# EasyEDA Pro project 2轴4.0控制板PCB源文件（LY-2X4.5-V4-ESD）.eprj, board 2轴4.0-
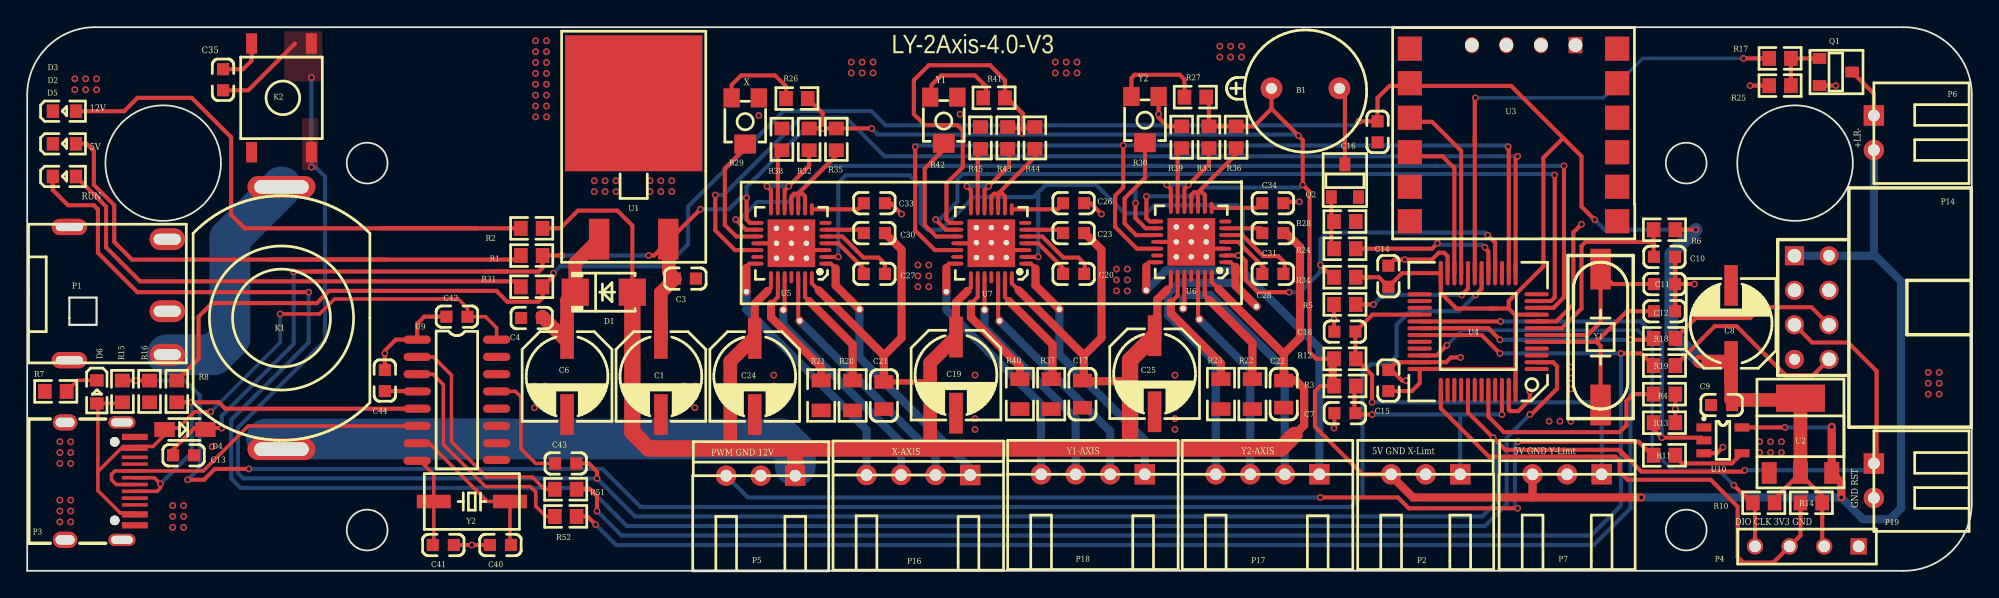
[diagram p1: board, top side]
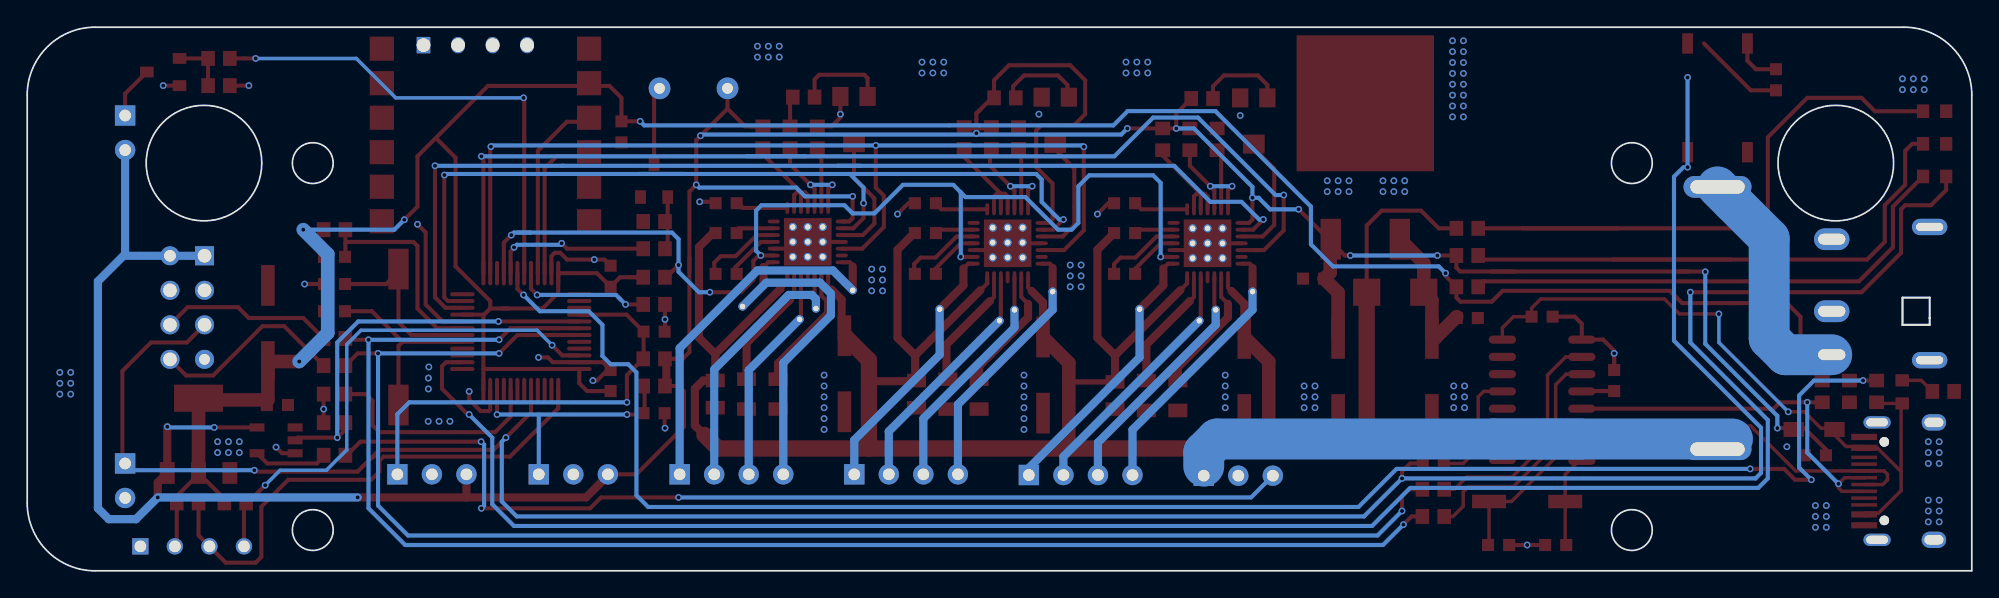
[diagram p2: board, bottom side, seen from below]

Outline 143 x 40 mm; copper layers: Top Layer, Bottom Layer. Coordinates in mm from the lower left corner of the outline.
Outline path: circle c10,30 r4.25 ; circle c25,30 r1.5 ; circle c25,3 r1.5 ; circle c122,30 r1.5 ; circle c122,3 r1.5 ; circle c130,30 r4.25 ; 0,35 0,0 138,0 arc(141.54,1.46) 143,5 143,35 arc(141.54,38.54) 138,40 5,40 arc(1.46,38.54) 0,35
Stack: Top Layer 0.0356mm / Dielectric1 0.32mm FR-4 er 4.8 / Bottom Layer 0.0356mm

## Design rules (mm)
net D6: Outside Board Components
net D5: Outside Board Components
net R15: Outside Board Components
net P3: Outside Board Components
net D2: Outside Board Components
net D3: Outside Board Components
net R7: Outside Board Components
net Y2: Inside Board Components
net U10: Inside Board Components
net U9: Inside Board Components
net R52: Inside Board Components
net R51: Inside Board Components
net C44: Inside Board Components
net C43: Inside Board Components
net C42: Inside Board Components
net C41: Inside Board Components
net C40: Inside Board Components
net R39: Inside Board Components
net R36: Inside Board Components
net R33: Inside Board Components
net R30: Inside Board Components
net R27: Inside Board Components
net U7: Inside Board Components
net U5: Inside Board Components
net R38: Inside Board Components
net R35: Inside Board Components
net R32: Inside Board Components
net R29: Inside Board Components
net R26: Inside Board Components
net R21: Inside Board Components
net R20: Inside Board Components
net P16: Inside Board Components
net C33: Inside Board Components
net C30: Inside Board Components
net C27: Inside Board Components
net C24: Inside Board Components
net C21: Inside Board Components
net R45: Inside Board Components
net R44: Inside Board Components
net R43: Inside Board Components
net R42: Inside Board Components
net R41: Inside Board Components
net R40: Inside Board Components
net R37: Inside Board Components
net C26: Inside Board Components
net C23: Inside Board Components
net C20: Inside Board Components
net C19: Inside Board Components
net C17: Inside Board Components
net U2: Inside Board Components
net U1: Inside Board Components
net R2: Inside Board Components
net R1: Inside Board Components
net D1: Inside Board Components
net C9: Inside Board Components
net C8: Inside Board Components
net C6: Inside Board Components
net C4: Inside Board Components
net C3: Inside Board Components
net C1: Inside Board Components
net R31: Inside Board Components
net R34: Inside Board Components
net Y1: Inside Board Components
net P4: Inside Board Components
net R25: Inside Board Components
net R24: Inside Board Components
net R17: Inside Board Components
net R14: Inside Board Components
net R13: Inside Board Components
net R10: Inside Board Components
net P6: Inside Board Components
net C7: Inside Board Components
net C10: Inside Board Components
net C11: Inside Board Components
net C12: Inside Board Components
net C14: Inside Board Components
net C15: Inside Board Components
net C16: Inside Board Components
net C18: Inside Board Components
net C22: Inside Board Components
net C25: Inside Board Components
net C28: Inside Board Components
net C31: Inside Board Components
net C34: Inside Board Components
net P2: Inside Board Components
net P7: Inside Board Components
net P5: Inside Board Components
net P14: Inside Board Components
net P17: Inside Board Components
net R3: Inside Board Components
net R4: Inside Board Components
net R5: Inside Board Components
net R6: Inside Board Components
net R11: Inside Board Components
net R12: Inside Board Components
net R18: Inside Board Components
net R19: Inside Board Components
net R22: Inside Board Components
net R23: Inside Board Components
net U3: Inside Board Components
net U4: Inside Board Components
net U6: Inside Board Components
net Q1: Inside Board Components
net Q2: Inside Board Components
net R28: Inside Board Components
net B1: Inside Board Components
net P18: Inside Board Components
net P19: Inside Board Components
net C13: Inside Board Components
net D4: Inside Board Components
net K1: Inside Board Components
net K2: Inside Board Components
net P1: Inside Board Components
net R8: Inside Board Components
net R16: Inside Board Components
net C35: Inside Board Components
spacing Clearance (default): track to track 0.178, other pairs 0.178 to 0.178
track width Width (default): min 0.1, default 0.254, max 5
differential pair DiffPairsRouting (default): width min 0.381, default 0.381, max 0.381; gap min 0.254, default 0.254
via RoutingVias (default): diameter min 0.3, default 0.8, max 1.27; hole min 0.3, default 0.6, max 2

## Placement (name value [footprint] x y rotation side)
B1  蜂鸣器  [蜂鸣器9]  94 35.5 0 top
C1  100uF/35V  [电解电容贴片6X6]  46.6 14.3 270 top
C3  104  [0603C]  48.4 21.5 180 top
C4  104  [0603C]  37.1 18.6 0 top
C6  100uF/35V  [电解电容贴片6X6]  39.7 14.3 270 top
C7  103  [0603C]  96.9 11.6 0 top
C8  100uF/35V  [电解电容贴片6X6]  125.3 18.2 90 top
C9  104  [0603C]  124.6 12.2 0 top
C10  104  [0603C]  120.4 23.1 180 top
C11  100pF  [0603C]  120.4 21.1 0 top
C12  100pF  [0603C]  120.4 19.1 0 top
C13  104  [0603C]  11.5 8.5 180 top
C14  104  [0603C]  100.1 21.67 270 top
C15  104  [0603C]  100.1 14 270 top
C16  104  [0603C]  99.3 32.3 90 top
C17  105  [0805C]  77.6 13 270 top
C18  103  [0603C]  96.9 17.6 0 top
C19  100uF/35V  [电解电容贴片6X6]  68.3 14.4 270 top
C20  104  [0603C]  76.95 21.85 0 top
C21  105  [0805C]  63 12.9 270 top
C22  105  [0805C]  92.4 13 270 top
C23  104  [0603C]  76.95 24.85 0 top
C24  100uF/35V  [电解电容贴片6X6]  53.5 14.3 270 top
C25  100uF/35V  [电解电容贴片6X6]  82.91 14.5 270 top
C26  224  [0603C]  76.95 27.05 0 top
C27  104  [0603C]  62.3 21.85 0 top
C28  104  [0603C]  91.6 21.85 0 top
C30  104  [0603C]  62.3 24.85 0 top
C31  104  [0603C]  91.6 24.85 0 top
C33  224  [0603C]  62.3 27.05 0 top
C34  224  [0603C]  91.6 27.05 0 top
C35  104  [0603C]  14.4 36.13 90 top
C40  18pF  [0603C]  34.8 1.9 180 top
C41  18pF  [0603C]  30.6 1.9 0 top
C42  104  [0603C]  31.6 18.7 180 top
C43  104  [0603C]  39.6 7.9 0 top
C44  104  [0603C]  26.3 14 90 top
D1  SS34  [SMA]  42.4 20.5 0 top
D2  红光  [0603LED]  2.7 31.4 180 top
D3  红光  [0603LED]  2.7 33.8 180 top
D4  S4  [SOD-123]  11.6 10.4 0 top
D5  绿光  [0603LED]  2.7 29 180 top
D6  红光  [0603LED]  5.1 13.2 90 top
K1  按键  [按键18X13]  18.7 18.6 90 top
K2  开关  [按键6X6贴片]  18.7 34.8 0 top
NOREF  -  [Pad_ie33]  57.3 25.2 0 top
NOREF#2  -  [Pad_ie21]  61.2 19.25 180 top
NOREF#3  -  [Pad_ie42]  85.6 23.1 180 top
NOREF#4  -  [Pad_ie16]  69.8 24.15 180 top
NOREF#5  -  [Pad_ie9]  70.4 19.2 180 top
NOREF#6  -  [Pad_ie24]  55.6 19.2 180 top
NOREF#7  -  [Pad_ie15]  70.9 24.15 90 top
NOREF#8  -  [Pad_ie27]  57.3 23 0 top
NOREF#9  -  [Pad_ie46]  82.29 20.65 180 top
NOREF#10  -  [Pad_ie18]  70.9 25.25 90 top
NOREF#11  -  [Pad_ie26]  55.1 23 180 top
NOREF#12  -  [Pad_ie37]  86.7 24.2 0 top
NOREF#13  -  [Pad_ie12]  70.9 23.05 180 top
NOREF#14  -  [Pad_ie38]  84.5 24.2 180 top
NOREF#15  -  [Pad_ie23]  56.8 18.4 180 top
NOREF#16  -  [Pad_ie39]  85.6 24.2 90 top
NOREF#17  -  [Pad_ie40]  86.7 23.1 0 top
NOREF#18  -  [Pad_ie29]  55.1 24.1 180 top
NOREF#19  -  [Pad_ie45]  86.2 18.5 180 top
NOREF#20  -  [Pad_ie35]  84.5 25.3 180 top
NOREF#21  -  [Pad_ie34]  86.7 25.3 0 top
NOREF#22  -  [Pad_ie47]  67.59 20.54 180 top
NOREF#23  -  [Pad_ie41]  84.5 23.1 180 top
NOREF#24  -  [Pad_ie30]  57.3 24.1 0 top
NOREF#25  -  [Pad_ie13]  69.8 23.05 180 top
NOREF#26  -  [Pad_ie32]  55.1 25.2 180 top
NOREF#27  -  [Pad_ie11]  75.9 19.25 180 top
NOREF#28  -  [Pad_ie25]  56.2 23 180 top
NOREF#29  -  [Pad_ie31]  56.2 25.2 90 top
NOREF#30  -  [Pad_ie20]  72 25.25 0 top
NOREF#31  -  [Pad_ie36]  85.6 25.3 90 top
NOREF#32  -  [Pad_ie43]  90.4 19.45 180 top
NOREF#33  -  [Pad_ie17]  72 24.15 0 top
NOREF#34  -  [Pad_ie44]  85 19.3 180 top
NOREF#35  -  [Pad_ie19]  69.8 25.25 180 top
NOREF#36  -  [Pad_ie28]  56.2 24.1 90 top
NOREF#37  -  [Pad_ie14]  72 23.05 0 top
NOREF#38  -  [Pad_ie10]  71.5 18.4 180 top
NOREF#39  -  [Pad_ie22]  52.89 20.54 180 top
P1  3P  [DC0044A]  0.1 19.1 0 top
P2  3P  [HDR1X3_P]  102.84 7.1 0 top
P3  USB-B10-BRW  [USB-TYPE-C-16P]  5.2 6.6 270 top
P4  4P  [SIP4]  134.68 1.8 180 top
P5  3P  [HDR1X3_P]  53.94 7 0 top
P6  2P  [HDR1X2_P]  135.8 33.5 90 top
P7  3P  [HDR1X3_P]  113.24 7.1 0 top
P14  8P  [IDC8弯脚]  131.23 19.37 270 top
P16  4P  [HDR1X4_P]  64.26 7.05 0 top
P17  4P  [HDR1X4_P]  89.94 7.1 0 top
P18  4P  [HDR1X4_P]  77.1 7.1 0 top
P19  2P  [HDR1X2_P]  135.8 7.9 90 top
Q1  SS8050  [SOT-23]  133 36.7 270 top
Q2  SS8050  [SOT-23]  96.9 28.7 0 top
R1  10K  [0603R]  37.1 23.2 180 top
R2  2K  [0603R]  37.1 25.2 180 top
R3  10K  [0603R]  96.9 13.6 180 top
R4  10K  [0603R]  120.4 13 180 top
R5  10K  [0603R]  96.9 19.6 0 top
R6  10K  [0603R]  120.4 25.1 180 top
R7  1K  [0603R]  2.1 13.2 0 top
R8  5.1K  [0603R]  11 13.2 270 top
R10  10K  [0603R]  127.7 5 0 top
R11  100  [0603R]  120.4 8.5 180 top
R12  10K  [0603R]  96.9 15.6 180 top
R13  2K  [0603R]  120.4 10.9 180 top
R14  10K  [0603R]  131.2 5 0 top
R15  5.1K  [0603R]  7 13.2 270 top
R16  10K  [0603R]  9 13.2 90 top
R17  2K  [0603R]  128.9 37.7 0 top
R18  100  [0603R]  120.4 17.1 0 top
R19  100  [0603R]  120.4 15.1 0 top
R20  0.1  [0805R]  60.7 12.9 270 top
R21  0.1  [0805R]  58.39 12.9 90 top
R22  0.1  [0805R]  90.1 13 270 top
R23  0.1  [0805R]  87.79 13 90 top
R24  2K  [0603R]  96.9 23.7 180 top
R25  10K  [0603R]  128.9 35.7 0 top
R26  30K  [0603R]  56.6 34.75 0 top
R27  30K  [0603R]  85.9 34.85 0 top
R28  10K  [0603R]  96.9 25.7 180 top
R29  10K  [松下贴片电位器3X3]  52.8 33.05 180 top
R30  10K  [松下贴片电位器3X3]  82.2 33.15 180 top
R31  1K  [0603R]  37.1 20.9 0 top
R32  10K  [0603R]  57.5 31.75 270 top
R33  10K  [0603R]  86.9 31.9 270 top
R34  10K  [0603R]  96.9 21.6 0 top
R35  100  [0603R]  59.5 31.75 270 top
R36  100  [0603R]  88.9 31.9 270 top
R37  0.1  [0805R]  75.3 13 270 top
R38  10K?  [0603R]  55.5 31.75 90 top
R39  10K?  [0603R]  84.9 31.9 90 top
R40  0.1  [0805R]  73 13 90 top
R41  30K  [0603R]  71.1 34.8 0 top
R42  10K  [松下贴片电位器3X3]  67.4 33.1 180 top
R43  10K  [0603R]  72.1 31.85 270 top
R44  100  [0603R]  74.1 31.85 270 top
R45  10K?  [0603R]  70.1 31.85 90 top
R51  510Ω  [0603R]  39.6 6 0 top
R52  510Ω  [0603R]  39.6 4 0 top
U1  CJ7805  [TO-263-2]  44.6 24.4 270 top
U2  1117-3.3  [SOT-223]  130.4 9.9 0 top
U3  JY230  [舵螺仪JY-230]  109.3 32.2 0 top
U4  STM32F103C8T6/CBT6  [LQFP48]  106.7 17.6 180 top
U5  HR4988SQ  [QFN28]  55.94 24.2 90 top
U6  HR4988SQ  [QFN28]  85.34 24.3 90 top
U7  HR4988SQ  [QFN28]  70.64 24.2 90 top
U9  CH340G/CH340C  [SOP16]  31.6 13.2 0 top
U10  74LVC1G17  [SOT-23-5]  124.7 9.6 0 top
Y1  8M  [晶振贴片]  115.7 17.2 90 top
Y2  12M  [晶振贴片49SSMD]  32.7 5.1 0 top

## Footprints (pads in the part's own frame, mm; a bottom-side part is the same pattern mirrored in y, then rotated)
0603C
  rect 0.889x0.889 smd: 1(-0.774,0) 2(0.774,0)
0603LED
  rect 0.9x1 smd: 1(-0.884,-0.017) 2(0.816,-0.017)
0603R
  rect 1x1.1 smd: 1(-0.8,0) 2(0.8,0)
0805C
  rect 1x1.4 smd: 1(-1,0) 2(1,0)
0805R
  rect 1x1.4 smd: 1(-1.1,0) 2(1.1,0)
DC0044A
  oval 2.6x1.6 hole 2x0.8: 1(10.2,-3.2) 2(10.2,0) 3(10.2,5.3)
  oval 2.6x1.2 hole 2x0.6: 4(3,6.2) 5(3,-3.6)
HDR1X2_P
  rect 1.5x1.5 hole 0.86: 1(0,0)
  round 1.5 hole 0.86: 2(-2.54,0)
HDR1X3_P
  rect 1.5x1.5 hole 0.86: 1(2.54,0)
  round 1.5 hole 0.86: 2(0,0) 3(-2.54,0)
HDR1X4_P
  rect 1.5x1.5 hole 0.86: 1(5.08,0)
  round 1.5 hole 0.86: 2(2.54,0) 3(0,0) 4(-2.54,0)
IDC8弯脚
  rect 1.4x1.4 hole 1: 1(-3.81,-1.27)
  round 1.4 hole 0.86: 2(-3.81,1.27)
  round 1.4 hole 1: 3(-1.27,-1.27) 4(-1.27,1.27) 5(1.27,-1.27) 6(1.27,1.27) 8(3.81,1.27)
  round 1.4 hole 0.8: 7(3.81,-1.27)
LQFP48
  oval 1.8x0.3 smd: 1(-4.3,2.75) 2(-4.3,2.25) 3(-4.3,1.75) 4(-4.3,1.25) 5(-4.3,0.75) 6(-4.3,0.25) 7(-4.3,-0.25) 8(-4.3,-0.75) 9(-4.3,-1.25) 10(-4.3,-1.75) 11(-4.3,-2.25) 12(-4.3,-2.75) 25(4.3,-2.75) 26(4.3,-2.25) 27(4.3,-1.75) 28(4.3,-1.25) 29(4.3,-0.75) 30(4.3,-0.25) 31(4.3,0.25) 32(4.3,0.75) 33(4.3,1.25) 34(4.3,1.75) 35(4.3,2.25) 36(4.3,2.75)
  oval 0.3x1.8 smd: 13(-2.75,-4.3) 14(-2.25,-4.3) 15(-1.75,-4.3) 16(-1.25,-4.3) 17(-0.75,-4.3) 18(-0.25,-4.3) 19(0.25,-4.3) 20(0.75,-4.3) 21(1.25,-4.3) 22(1.75,-4.3) 23(2.25,-4.3) 24(2.75,-4.3) 37(2.75,4.3) 38(2.25,4.3) 39(1.75,4.3) 40(1.25,4.3) 41(0.75,4.3) 42(0.25,4.3) 43(-0.25,4.3) 44(-0.75,4.3) 45(-1.25,4.3) 46(-1.75,4.3) 47(-2.25,4.3) 48(-2.75,4.3)
Pad_ie9
  round 0.6 hole 0.4: 0(0,0)
Pad_ie10
  round 0.6 hole 0.4: 0(0,0)
Pad_ie11
  round 0.6 hole 0.4: 0(0,0)
Pad_ie12
  round 0.6 hole 0.4: 4(0,0)
Pad_ie13
  round 0.6 hole 0.4: 5(0,0)
Pad_ie14
  round 0.6 hole 0.4: 5(0,0)
Pad_ie15
  round 0.6 hole 0.4: 5(0,0)
Pad_ie16
  round 0.6 hole 0.4: 5(0,0)
Pad_ie17
  round 0.6 hole 0.4: 5(0,0)
Pad_ie18
  round 0.6 hole 0.4: 5(0,0)
Pad_ie19
  round 0.6 hole 0.4: 5(0,0)
Pad_ie20
  round 0.6 hole 0.4: 5(0,0)
Pad_ie21
  round 0.6 hole 0.4: 0(0,0)
Pad_ie22
  round 0.6 hole 0.4: 3(0,0)
Pad_ie23
  round 0.6 hole 0.4: 0(0,0)
Pad_ie24
  round 0.6 hole 0.4: 0(0,0)
Pad_ie25
  round 0.6 hole 0.4: 4(0,0)
Pad_ie26
  round 0.6 hole 0.4: 5(0,0)
Pad_ie27
  round 0.6 hole 0.4: 5(0,0)
Pad_ie28
  round 0.6 hole 0.4: 5(0,0)
Pad_ie29
  round 0.6 hole 0.4: 5(0,0)
Pad_ie30
  round 0.6 hole 0.4: 5(0,0)
Pad_ie31
  round 0.6 hole 0.4: 5(0,0)
Pad_ie32
  round 0.6 hole 0.4: 5(0,0)
Pad_ie33
  round 0.6 hole 0.4: 5(0,0)
Pad_ie34
  round 0.6 hole 0.4: 5(0,0)
Pad_ie35
  round 0.6 hole 0.4: 5(0,0)
Pad_ie36
  round 0.6 hole 0.4: 5(0,0)
Pad_ie37
  round 0.6 hole 0.4: 5(0,0)
Pad_ie38
  round 0.6 hole 0.4: 5(0,0)
Pad_ie39
  round 0.6 hole 0.4: 5(0,0)
Pad_ie40
  round 0.6 hole 0.4: 5(0,0)
Pad_ie41
  round 0.6 hole 0.4: 5(0,0)
Pad_ie42
  round 0.6 hole 0.4: 4(0,0)
Pad_ie43
  round 0.6 hole 0.4: 0(0,0)
Pad_ie44
  round 0.6 hole 0.4: 0(0,0)
Pad_ie45
  round 0.6 hole 0.4: 0(0,0)
Pad_ie46
  round 0.6 hole 0.4: 3(0,0)
Pad_ie47
  round 0.6 hole 0.4: 3(0,0)
QFN28
  oval 0.28x0.895 smd: 1(-1.601,-2.756) 2(-1.101,-2.756) 3(-0.601,-2.756) 4(-0.1,-2.756) 5(0.401,-2.756) 6(0.9,-2.756) 7(1.401,-2.756) 15(1.401,2.244) 16(0.9,2.244) 17(0.401,2.244) 18(-0.1,2.244) 19(-0.601,2.244) 20(-1.101,2.244) 21(-1.601,2.244)
  oval 0.895x0.28 smd: 8(2.4,-1.758) 9(2.4,-1.257) 10(2.4,-0.756) 11(2.4,-0.256) 12(2.4,0.244) 13(2.4,0.745) 14(2.4,1.245) 22(-2.6,1.245) 23(-2.6,0.745) 24(-2.6,0.244) 25(-2.6,-0.256) 26(-2.6,-0.756) 27(-2.6,-1.257) 28(-2.6,-1.758)
  rect 3.5x3.5 smd: 29(-0.1,-0.256)
SIP4
  rect 1.2x1.2 hole 0.86: 1(0,0)
  round 1.2 hole 0.86: 2(2.54,0) 3(5.08,0) 4(7.62,0)
SMA
  rect 2x2 smd: 1(2.1,0) 2(-2.1,0)
SOD-123
  rect 1.5x1.1 smd: 1(-1.5,0) 2(1.5,0)
SOP16
  oval 2x0.6 smd: 1(-2.921,3.81) 2(-2.921,2.54) 3(-2.921,1.27) 4(-2.921,0) 5(-2.921,-1.27) 6(-2.921,-2.54) 7(-2.921,-3.81) 8(-2.921,-5.11) 9(2.921,-5.04) 10(2.921,-3.81) 11(2.921,-2.54) 12(2.921,-1.27) 13(2.921,0) 14(2.921,1.27) 15(2.921,2.54) 16(2.921,3.81)
SOT-23
  rect 0.8x1 smd: 1(-1,-1.2) 2(0,1.2) 3(1,-1.2)
SOT-23-5
  rect 1.1x0.6 smd: 1(-1.4,0.95) 2(-1.4,0) 3(-1.4,-0.95) 4(1.4,-0.95) 5(1.4,0.95)
SOT-223
  rect 1.1x1.6 smd: 1(-2.3,-2.7) 2(0,-2.7) 3(2.3,-2.7)
  rect 3.6x2 smd: 4(0,2.8)
TO-263-2
  rect 3x1.5 smd: 1(0,-2.54) 3(0,2.54)
  rect 10x10.1 smd: 2(-10,0)
USB-TYPE-C-16P
  round 0.7 hole 0.7: (-2.89,1.235) (2.89,1.235)
  oval 0.9x2 hole 0.6x1.6: 1(-4.32,1.765) 2(4.32,1.765)
  oval 1.2x1.8 hole 0.7x1.4: 3(-4.32,-2.415) 4(4.32,-2.415)
  rect 0.26x1.9 smd: A1(-3.35,2.715) A4(-2.55,2.715) A5(-1.25,2.715) A6(-0.25,2.715) A7(0.25,2.715) A8(1.25,2.715) A9(2.55,2.715) A12(3.35,2.715) B1(3.15,2.715) B4(2.35,2.715) B5(1.75,2.715) B6(0.75,2.715) B7(-0.75,2.715) B8(-1.75,2.715) B9(-2.35,2.715) B12(-3.15,2.715)
按键6X6贴片
  rect 0.8x1.5 smd: 1(2.2,4) 2(-2.2,4) 3(2.2,-4) 4(-2.2,-4)
按键18X13
  oval 1.6x5 hole 1x4: 1(-9.65,0) 2(9.65,0)
晶振贴片
  rect 3x1.5 smd: 1(-5,0) 2(5,0)
晶振贴片49SSMD
  rect 2.5x1 smd: 1(-2.8,0) 2(2.8,0)
松下贴片电位器3X3
  rect 1.2x1.4 smd: 1(-1,-1.75) 3(1,-1.75)
  rect 1.6x1.4 smd: 2(0,1.65)
电解电容贴片6X6
  rect 3x1 smd: 1(-2.8,0) 2(2.8,0)
舵螺仪JY-230
  oval 1x1.2 hole 1.7: 0(-3.064,6.481) 0(-0.524,6.481) 0(2.016,6.481)
  rect 1x1.2 hole 1.7: 0(4.556,6.481)
  rect 1.778x1.778 smd: 1(-7.62,6.218) 2(-7.62,3.679) 3(-7.62,1.139) 4(-7.62,-1.401) 5(-7.62,-3.942) 6(-7.62,-6.481) 7(7.62,-6.481) 8(7.62,-3.942) 9(7.62,-1.401) 10(7.62,1.139) 11(7.62,3.679) 12(7.62,6.218)
蜂鸣器9
  round 1.6 hole 0.8: 1(-2.5,0) 2(2.5,0)

## Nets
As in the schematic, except:
3V3: C8.1 C9.2 C14.2 C15.2 C16.2 P4.2 R6.1 R8.1 R10.2 R14.2 R31.2 R34.2 U2.2 U2.4 U3.2 U4.9 U4.24 U4.36 U4.48
GND: C1.2 C3.1 C4.1 C6.2 C7.1 C8.2 C9.1 C10.1 C11.2 C12.2 C13.1 C14.1 C15.1 C16.1 C17.2 C18.1 C19.2 C21.2 C22.2 C24.2 C25.2 C26.2 C33.2 C34.2 C35.2 C40.2 C41.2 C42.2 C44.2 D2.2 D3.2 K2.2 NOREF.5 NOREF#3.4 NOREF#4.5 NOREF#7.5 NOREF#8.5 NOREF#10.5 NOREF#11.5 NOREF#12.5 NOREF#13.4 NOREF#14.5 NOREF#16.5 NOREF#17.5 NOREF#18.5 NOREF#20.5 NOREF#21.5 NOREF#23.5 NOREF#24.5 NOREF#25.5 NOREF#26.5 NOREF#28.4 NOREF#29.5 NOREF#30.5 NOREF#31.5 NOREF#33.5 NOREF#35.5 NOREF#36.5 NOREF#37.5 P1.2 P1.3 P2.2 P3.1 P3.2 P3.3 P3.4 P3.A1 P3.A12 P3.B1 P3.B12 P4.1 P5.2 P7.2 P14.3 P14.4 P19.2 Q1.3 Q2.3 R4.1 R5.1 R7.1 R13.1 R16.1 R20.2 R21.1 R22.2 R23.1 R25.1 R28.1 R29.1 R30.1 R37.2 R38.2 R39.2 R40.1 R42.1 R45.2 U1.2 U2.1 U3.5 U4.8 U4.23 U4.35 U4.47 U5.3 U5.18 U5.29 U6.3 U6.18 U6.29 U7.3 U7.18 U7.29 U9.1 U10.3
VCC: B1.1 C1.1 C3.2 C13.2 D4.2 P2.3 P6.2 P7.3 P14.1 P14.2 R1.1 R3.2 R12.2 R26.2 R27.2 R32.1 R33.1 R35.1 R36.1 R41.2 R43.1 R44.1 U1.3 U2.3 U5.15 U6.15 U7.15 U10.5
GYRO_RX: U3.4 U4.22
GYRO_TX: U3.3 U4.21
MX_1A: NOREF#6.0 P16.3 U5.24
MX_1B: NOREF#39.3 P16.4 U5.21
MX_2A: NOREF#15.0 P16.2 U5.26
MX_2B: NOREF#2.0 P16.1 U5.1
MY1_1A: NOREF#34.0 P17.2 U6.24
MY1_1B: NOREF#9.3 P17.1 U6.21
MY1_2A: NOREF#19.0 P17.3 U6.26
MY1_2B: NOREF#32.0 P17.4 U6.1
MY2_1A: NOREF#5.0 P18.3 U7.24
MY2_1B: NOREF#22.3 P18.4 U7.21
MY2_2A: NOREF#38.0 P18.2 U7.26
MY2_2B: NOREF#27.0 P18.1 U7.1
RST: C35.1 C43.2 K2.1 K2.3 P14.5 P19.1 U4.41
USB_DM: P3.A7 P3.B7 U9.6
USB_DP: P3.A6 P3.B6 R8.2 U9.5
VUSB: C42.1 D4.1 D6.1 P3.A4 P3.A9 P3.B4 P3.B9 R15.2 U9.16

Pads without a net: K2 4; P1 4 5; P3 A5 A8 B5 B8; P14 7; U3 0 1 6 7 8 9 10 11 12; U4 1 3 4 32 33; U5 7 20 25; U6 7 20 25; U7 7 20 25; U9 9 10 11 12 14 15; U10 1

## Via types
v1: diameter 0.5, hole 0.3, Top Layer to Bottom Layer, 229 vias

## Routing (per net, layer and track width the routed paths; a pad name or vN(x,y) marks a point on that pad's centre or on a via; arc(x,y) is an arc through that point)
3V3: length 221.1
  Top Layer w0.3: U4.48 109.45,14.85 ; 107.6,19.3 105.1,19.3 103.95,20.45 U4.24 101.1,21.9 C14.2 99.4,21.6 R34.2 98.8,21.6 ; 107.6,19.3 108.95,19.3 ; 107.6,19.3 108.1,19.3 ; v1(115.27,25.83) 114.3,26.8 114.3,30.5 109.12,35.68 101.68,35.68 ; 109.45,14.85 109.45,18.8 109.4,18.85 ; 109.45,14.85 U4.36 102.4,13.8 101.83,13.23 C15.2 ; v1(97.93,33.07) C16.2 99.3,34.8 100.18,35.68 101.68,35.68 ; R31.2 38.7,21.7 v1(38.7,21.9) ; R31.2 37.9,20.5 ; R31.2 37.9,20.1 37.6,19.8 35.3,19.8 34.5,20.6 22.2,20.6 21.3,19.7 17.9,19.7 ; 108.95,19.3 108.95,19.85 111.5,22.4 111.5,30.4 112.87,31.77 ; 108.95,19.3 109.4,18.85 ; R14.2 132,5.5 130.4,7.1 U2.2 128.5,5.3 R10.2 ; R14.2 132,1.94 P4.2 ; R14.2 132,4.53 ; 109.4,18.85 U4.9 ; 101.68,35.68 101.6,35.6 ; 17.9,19.7 17.3,19.7 ; 17.9,19.7 13.6,19.7 12.6,18.7 12.6,15.6 R8.1 ; R6.1 v1(122.7,25.1)
  Top Layer w1: U2.2 U2.4 130.27,12.57 125.3,12.57 C8.1 v1(123,15.4)
  Bottom Layer w0.3: v1(97.93,33.07) 97.62,32.77 75.2,32.77 ; v1(122.7,25.1) 116,25.1 v1(115.27,25.83) ; v1(38.7,21.9) 39.2,22.4 46.98,22.4 48.6,24.02 48.6,26.8 55.63,33.83 62.07,33.83 63.13,32.77 72.96,32.77 ; 72.96,32.78 75.2,32.78
  Bottom Layer w1: v1(122.7,25.1) 120.9,23.3 120.9,17.5 v1(123,15.4)
12V: length 236
  Top Layer w0.3: 87.1,21.7 87.1,21.25 87.9,20.45 ; R2.1 39.2,25.2 40.5,26.5 43.4,26.5 44.5,25.4 D1.1 ; 83.85,20.7 84.1,20.95 U6.22 ; 54.7,21.6 54.7,20.85 54.45,20.6 ; 58.2,20.65 57.7,21.15 U5.28 ; 69.15,20.6 69.4,20.85 69.4,21.6 ; 72.9,20.65 72.4,21.15 U7.28
  Top Layer w0.4: 63.45,13.9 C21.1 66.4,13.9
  Top Layer w0.6: C21.1 63,15.85 ; 63,15.85 58.2,20.65 ; 63,15.85 64.3,17.15 64.3,23.62 C30.2 ; 77.7,13.95 80.85,13.95 81.1,13.7 ; 77.7,15.85 79,17.15 79,23.62 77.77,24.85 ; 77.7,15.85 72.9,20.65 ; 77.7,15.85 77.7,13.9 ; 93.2,10 93.9,10.7 93.9,13.4 93.3,14 C22.1 92.4,15.95 ; 92.4,15.95 93.6,17.15 93.6,23.83 92.47,24.95 ; 92.4,15.95 87.6,20.75 ; 54.45,20.6 53.5,19.65 53.5,17.2 ; C19.1 68.3,19.75 69.15,20.6 ; 82.8,17.2 83.11,17.51 83.11,19.96 83.85,20.7
  Top Layer w1: 53.5,17.2 51.7,15.4 51.7,9 ; C19.1 66.4,15.3 66.4,9
  Top Layer w1.2: 82.8,17.01 82.8,17.2 81.1,15.5 81.1,9 ; 56.6,9 81.1,9 ; 56.6,9 45.7,9 44.5,10.2 D1.1 ; 56.6,9 56.48,8.88 P5.1 ; 81.1,9 92.2,9 93.2,10
  Bottom Layer w3: 56.48,7.7 56.48,8.72 55.5,9.7 35.2,9.7 ; 17.6,9.7 35.2,9.7 ; 35.2,9.7 28.7,9.7
GND: length 78.7
  Top Layer w0.3: U7.18 U7.29 71.4,23.6 U7.3 ; C18.1 96.1,17.63 R5.1 ; v1(126.7,35.7) R25.1 ; U6.18 NOREF#14.5 ; v1(110.5,13.2) 110.5,12.6 109.65,11.75 109.05,11.75 108.95,11.85 U4.47 ; R13.1 R4.1 ; R30.1 83.2,33.35 83.85,32.7 R39.2 ; v1(26.3,16) C44.2 26.3,16.2 27.11,17.01 28.68,17.01 28.68,18.18 29.2,18.7 C42.2 ; U4.8 112.45,18.35 113.7,19.6 113.7,24.9 v1(114.3,25.5) ; U10.3 124.25,8.65 v1(124.7,9.1) ; v1(64.3,26.25) 63.5,27.05 C33.2 ; C35.2 15.87,36.91 16.5,37.53 K2.2 ; Q1.3 v1(133,35.7) ; C11.2 v1(122.6,21.1) ; C11.2 C12.2 ; C11.2 C10.1 ; U5.18 U5.29 56.7,23.6 U5.3 ; 96.13,10.5 C7.1 ; v1(101.4,14) 101.1,14 100.33,14.77 C15.1 100.68,15.35 U4.35 104.35,15.35 104.7,15.7 v1(105.4,15.7) ; U6.3 86.1,23.7 NOREF#16.5 ; 78.2,27.05 v1(79,26.25) ; 100.1,22.45 100.55,22.9 103.3,22.9 103.8,23.4 104.2,23.4 104.45,23.15 U4.23 ; C41.2 C40.2 ; 92.37,27.15 v1(93.55,27.15)
  vias: v1(2.4,9.5) v1(2.4,8.7) v1(2.4,7.9) v1(2.4,5.2) v1(2.4,4.4) v1(2.4,3.6) v1(3.2,9.5) v1(3.2,8.7) v1(3.2,7.9) v1(3.2,5.2) v1(3.2,4.4) v1(3.2,3.6) v1(3.5,36.2) v1(3.5,35.4) v1(4.3,36.2) v1(4.3,35.4) v1(5.1,36.2) v1(5.1,35.4) v1(10.7,4.8) v1(10.7,4) v1(10.7,3.2) v1(11.5,4.8) v1(11.5,4) v1(11.5,3.2) v1(13.6,9.13) v1(32.7,1.9) v1(37.3,13.6) v1(37.3,12.8) v1(37.3,12) v1(37.39,39) v1(37.39,38.2) v1(37.39,37.4) v1(37.39,36.6) v1(37.39,35.8) v1(37.39,35) v1(37.39,34.2) v1(37.39,33.4) v1(38.1,13.6) v1(38.1,12.8) v1(38.1,12) v1(38.19,39) v1(38.19,38.2) v1(38.19,37.4) v1(38.19,36.6) v1(38.19,35.8) v1(38.19,35) v1(38.19,34.2) v1(38.19,33.4) v1(41.7,28.7) v1(41.7,27.9) v1(42.5,28.7) v1(42.5,27.9) v1(43.3,28.7) v1(43.3,27.9) v1(45.8,28.7) v1(45.8,27.9) v1(46.6,28.7) v1(46.6,27.9) v1(47.4,28.7) v1(47.4,27.9) v1(48.3,13.6) v1(48.3,12.8) v1(48.3,12) v1(49.1,13.6) v1(49.1,12.8) v1(49.1,12) v1(53.8,33.5) v1(54.9,14.4) v1(54.9,13.6) v1(54.9,12.8) v1(54.9,12) v1(60.6,37.43) v1(60.6,36.63) v1(61.4,37.43) v1(61.4,36.63) v1(62.2,37.43) v1(62.2,36.63) v1(65.5,22.5) v1(65.5,21.7) v1(65.5,20.9) v1(66.3,22.5) v1(66.3,21.7) v1(66.3,20.9) v1(68.6,33.6) v1(69.7,14.4) v1(69.7,13.6) v1(69.7,12.8) v1(69.7,12) v1(69.7,11.2) v1(69.7,10.4) v1(75.6,37.43) v1(75.6,36.63) v1(76.4,37.43) v1(76.4,36.63) v1(77.2,37.43) v1(77.2,36.63) v1(80.1,22.2) v1(80.1,21.4) v1(80.1,20.6) v1(80.9,22.2) v1(80.9,21.4) v1(80.9,20.6) v1(83.2,33.6) v1(84.4,14.4) v1(84.4,13.6) v1(84.4,12.8) v1(84.4,12) v1(84.4,11.2) v1(84.4,10.4) v1(87.7,38.6) v1(87.7,37.8) v1(88.5,38.6) v1(88.5,37.8) v1(89.3,38.6) v1(89.3,37.8) v1(96.1,18.5) v1(96.1,10.5) v1(101.3,22.9) v1(111.91,11) v1(112.71,11) v1(113.46,15) v1(113.5,14.18) v1(113.5,13.38) v1(113.51,11) v1(121.2,11.9) v1(127.4,9.5) v1(127.4,8.7) v1(128.2,9.5) v1(128.2,8.7) v1(129,9.5) v1(129,8.7) v1(139.8,14.6) v1(139.8,13.8) v1(139.8,13) v1(140.6,14.6) v1(140.6,13.8) v1(140.6,13)
VCC: length 289.3
  Top Layer w0.3: R12.2 94.8,15.6 94.3,16.1 94.3,23 ; 91.5,34 90.2,32.7 R36.1 ; 91.5,34 B1.1 ; 91.5,34 93.8,31.7 v1(93.8,28.4) 94.3,27.9 94.3,23 ; R32.1 v1(58.5,32.55) ; v1(58.5,32.55) R35.1 v1(62.1,32.55) ; v1(58.5,32.55) 58.5,33.65 R26.2 ; 22,22.02 19.62,22.02 v1(19.6,22) ; 22,22.02 35.3,22.02 ; 22,22.02 20.82,22.02 ; v1(73.2,32.2) 73.2,32.55 ; 73.2,32.55 73.2,33.65 ; 73.2,32.55 72.2,32.55 ; 73.2,32.55 74.1,32.55 ; v1(14.3,10.5) 12.3,10.5 10.73,8.93 10.73,8.6 ; R27.2 86.9,34.65 R33.1 R36.1 ; R36.1 89.85,32.7 ; 94.3,23 94.3,21.98 ; 13.2,10.1 13.4,10.3 ; 35.3,22.02 37.62,22.02 37.9,22.3 R1.1 v1(39.3,23.2) ; 35.3,22.02 33.6,22.02 ; R3.2 95.1,13.6 94.7,13.2 94.7,10.6 98.2,7.1 P2.3 ; U10.5 v1(129.25,10.55) ; v1(82.3,27.55) 82.3,25.95 82.55,25.7 U6.15 ; v1(49.5,26.6) 46.1,23.2 v1(45.7,23.2) ; U7.15 67.85,25.6 67.6,25.85 67.6,28.5 68.8,29.7 68.8,32.4 68.4,32.8 66,32.8 65.2,33.6 65.2,36.1 66.3,37.2 70.8,37.2 71.9,36.1 R41.2 ; 72.8,34.05 73.2,33.65 ; 73.2,33.65 72.1,34.75 ; v1(52.9,27.45) 52.9,25.85 53.15,25.6 U5.15
  Top Layer w0.6: 110.7,5.4 v1(118.7,5.4) ; 110.7,5.4 P7.3 ; 110.7,5.4 101.9,5.4 100.25,7.05 ; v1(132.7,10.6) U2.3 133.4,6.5 v1(133.4,5.4) ; 96,13.6 96,15.6
  Top Layer w1: 47.18,24.28 47.18,21.95 C3.2 46.6,20.47 C1.1
  Bottom Layer w0.3: v1(19.6,22) 19.6,16.7 14.3,11.4 v1(14.3,10.5) ; v1(93.8,28.4) 93.6,28.2 86.45,28.2 85.8,27.55 v1(82.3,27.55) ; v1(39.3,23.2) v1(45.7,23.2) ; 73.2,32.1 93.5,32.1 ; 73.2,32.1 62.55,32.1 v1(62.1,32.55) ; 73.2,32.1 v1(73.2,32.2) ; v1(132.7,10.6) 132.65,10.55 v1(129.25,10.55) ; v1(58.5,32.55) 57.2,32.55 52.9,28.25 v1(52.9,27.45) 52.45,27.45 51.6,26.6 v1(49.5,26.6)
  Bottom Layer w0.6: P14.1 P14.2 135.68,23.18 ; v1(118.7,5.4) v1(133.4,5.4) 135,3.8 137,3.8 137.8,4.6 137.8,21.3 135.8,23.3 P6.2
  vias: v1(93.49,32.01)
BOOT0: length 16.8
  Top Layer w0.3: R4.2 118.1,13 117.6,12.5 117.6,10.7 117.1,10.2 108.6,10.2 107.45,11.35 U4.44
BOOT1: length 9.9
  Top Layer w0.3: U4.20 105.95,20.75 v1(105.5,20.3) ; R5.2 v1(99,19.6)
  Bottom Layer w0.3: v1(105.5,20.3) 99.7,20.3 v1(99,19.6)
BUZZER_EN: length 11.9
  Top Layer w0.3: U4.17 107.45,23.5 107.18,23.78 ; R24.1 103.3,23.7 v1(103.7,24.1) 103.7,24.04
  Bottom Layer w0.3: v1(107.2,23.8) 107.01,23.99 103.75,23.99 103.7,24.04 v1(103.7,24.1)
GYRO_RX: length 11.4
  Top Layer w0.3: U4.22 104.95,29.62 104.07,30.5 101.68,30.5
GYRO_TX: length 13.7
  Top Layer w0.3: 105.45,21.83 U4.21 105.45,30.9 103.31,33.04 101.68,33.04
LASER_LOCATION: length 36.4
  Top Layer w0.3: R17.1 v1(126.2,37.7) ; 106.45,31.3 106.45,34.75 v1(106.5,34.8) ; 106.45,31.3 U4.19 ; 106.45,31.3 106.45,32
  Bottom Layer w0.254: v1(126.2,37.7) 118.8,37.7 115.9,34.8 v1(106.5,34.8)
MOTOR_EN: length 81.3
  Top Layer w0.3: v1(92.8,20.5) 90.5,20.5 89.6,21.4 89.6,22.8 89.2,23.2 v1(89.05,23.2) U6.2 ; U7.2 v1(74.35,23.1) ; U4.16 107.95,24.15 v1(107.4,24.7) ; v1(95.1,22.5) 96,21.6 R34.1 ; U5.2 v1(59.65,23.1)
  Bottom Layer w0.3: v1(74.35,23.1) 74.35,27.85 ; 74.35,27.85 74,27.5 69.6,27.5 67.2,25.1 66.2,25.1 65.7,25.6 65.7,28.3 64.9,29.1 60.2,29.1 59.65,28.55 v1(59.65,23.1) ; 74.35,27.85 74.9,28.4 78.6,28.4 80.7,26.3 82.3,26.3 82.9,26.9 89,26.9 89.4,26.5 89.4,23.55 v1(89.05,23.2) ; 106,24.89 106.97,24.89 ; 106,24.89 95.59,24.89 95.1,24.4 v1(95.1,22.5) 95.1,22 93.6,20.5 v1(92.8,20.5) ; 106,24.89 107.21,24.89 v1(107.4,24.7)
MX_1A: length 18.2
  Top Layer w0.3: NOREF#6.0 55.7,19.3 U5.24
  Bottom Layer w0.6: NOREF#6.0 55.6,18.1 64.26,9.44 P16.3
MX_1B: length 19.8
  Top Layer w0.3: 53.7,22.6 53.1,22.6 52.9,22.4
  Top Layer w0.6: NOREF#39.3 52.89,22.29
  Bottom Layer w0.6: P16.4 61.72,10.38 52.89,19.21 NOREF#39.3
MX_2A: length 18.7
  Top Layer w0.3: U5.26 56.7,18.5 NOREF#15.0
  Bottom Layer w0.6: P16.2 66.8,8.4 NOREF#15.0
MX_2B: length 20.2
  Top Layer w0.3: 59.45,22.25 59.1,22.6 58.7,22.6
  Top Layer w0.6: NOREF#2.0 59.45,21 59.45,22.25
  Bottom Layer w0.6: NOREF#2.0 61.2,15.7 69.34,7.56 P16.1
MX_DIR: length 82.1
  Top Layer w0.3: 52.35,23.6 52.7,23.6 ; 52.7,23.6 U5.19 ; 52.7,23.6 52.05,23.6 50.6,25.05 v1(50.6,27.65) ; U4.13 109.45,30.5
  Bottom Layer w0.3: 85.8,30.5 v1(109.6,30.5) ; 85.8,30.5 63.05,30.5 60.2,33.35 56.9,33.35 51.2,27.65 v1(50.6,27.65) ; 85.8,30.5 90.1,30.5
MX_STEP: length 78.3
  Top Layer w0.3: v1(52.1,25.85) 52.85,25.1 U5.16 ; U4.10 112.24,19.35 113.01,20.12 v1(113.01,29.8)
  Bottom Layer w0.3: 83.4,29.8 103.55,29.8 ; 83.4,29.8 81.7,29.8 ; 83.4,29.8 58.65,29.8 57.93,29.07 56,27.15 53.7,27.15 52.4,25.85 v1(52.1,25.85) ; 103.55,29.8 v1(113.01,29.8) ; 103.55,29.8 103.7,29.8
MY1_1A: length 20.8
  Top Layer w0.3: U6.24 85.1,19.4 NOREF#34.0
  Bottom Layer w0.3: NOREF#34.0 85.1,19.3
  Bottom Layer w0.6: P17.2 92.48,14.82 87,20.3 85.3,20.3 85,20 NOREF#34.0
MY1_1B: length 27.9
  Top Layer w0.3: 82.3,22.5 82.5,22.7 U6.21
  Top Layer w0.6: NOREF#9.3 82.29,22.4
  Bottom Layer w0.6: 94.79,7.33 P17.1 95.02,16.38 89.3,22.1 83.75,22.1 NOREF#9.3
MY1_2A: length 16.7
  Top Layer w0.3: 86.1,19.8 86.1,18.6 NOREF#19.0 ; 86.1,19.8 U6.26 ; 86.1,19.8 86.1,19.3
  Bottom Layer w0.6: NOREF#19.0 89.94,14.76 P17.3
MY1_2B: length 27.2
  Top Layer w0.3: U6.1 88.5,22.7 88.85,22.35
  Top Layer w0.6: 88.85,21.9 88.85,22.35 88.85,21 NOREF#32.0
  Bottom Layer w0.6: P17.4 87.4,15.3 83.9,18.8 83.9,20.4 84.7,21.2 88.65,21.2 NOREF#32.0
MY2_1A: length 17.2
  Top Layer w0.3: 70.4,19.3 U7.24
  Bottom Layer w0.6: P18.3 77.1,11.2 70.4,17.9 NOREF#5.0
MY2_1B: length 19
  Top Layer w0.3: 67.6,22.4 67.8,22.6 68.4,22.6
  Top Layer w0.6: NOREF#22.3 67.59,22.29
  Bottom Layer w0.6: P18.4 74.56,12.24 67.59,19.21 NOREF#22.3
MY2_2A: length 18.2
  Top Layer w0.3: NOREF#38.0 71.4,18.5 71.4,19.6 ; 71.4,19.6 71.4,19.3 ; 71.4,19.6 U7.26
  Bottom Layer w0.6: P18.2 79.64,10.26 NOREF#38.0
MY2_2B: length 19.4
  Top Layer w0.3: 73.4,22.6 73.8,22.6 74.15,22.25
  Top Layer w0.6: NOREF#27.0 74.15,21 74.15,22.25
  Bottom Layer w0.6: P18.1 82.18,9.62 75.9,15.9 NOREF#27.0
MY_DIR: length 73.7
  Top Layer w0.3: U6.19 81.6,23.7 80,25.3 80,26.7 ; v1(108.9,31.21) 108.95,31.16 U4.14 ; v1(80.6,31.3) 80.6,28.2 80,27.6 80,26.7 ; v1(65.3,31.2) 65.3,25.05 66.75,23.6 U7.19 ; 80,26.7 80,27.52
  Bottom Layer w0.3: v1(65.3,31.2) 65.4,31.3 v1(80.6,31.3) 108.81,31.3 v1(108.9,31.21)
MY_STEP: length 69.2
  Top Layer w0.3: U6.16 82.25,25.2 81.5,25.95 v1(81.5,27.05) ; U7.16 67.55,25.1 v1(66.8,25.85) ; U4.11 112.06,19.85 112.33,20.12 112.33,29.11 v1(112.32,29.12) 112.32,29.2
  Bottom Layer w0.3: 94.7,29.2 112.32,29.2 ; 94.7,29.2 82.5,29.2 ; 94.7,29.2 98,29.2 ; 82.5,29.2 68.8,29.2 68.4,28.8 68.4,27.15 67.1,25.85 v1(66.8,25.85) ; 82.5,29.2 81.5,28.2 v1(81.5,27.05)
NETB1_2: length 5.8
  Top Layer w0.3: B1.2 96.9,35.1 Q2.2
NETC4_2: length 10.8
  Top Layer w1: U1.1 40.3,22.64 D1.2 39.7,19.9 C6.1 39.47,17.1 37.87,18.7
NETC20_1: length 3.6
  Top Layer w0.3: 76.23,22.22 74.35,24.1 U7.4
NETC20_2: length 5.9
  Top Layer w0.3: 77.77,21.85 77.77,22.57 77.3,23.05 76.2,23.05 74.65,24.6 U7.5
NETC23_1: length 2.6
  Top Layer w0.3: U7.6 75.97,25.1
NETC26_1: length 4
  Top Layer w0.3: U7.8 75.78,26.6 76.23,27.05
NETC27_1: length 4
  Top Layer w0.3: U5.4 59.65,24.1 61.53,22.22 C27.1
NETC27_2: length 5.9
  Top Layer w0.3: C27.2 63.07,22.57 62.6,23.05 61.5,23.05 59.95,24.6 U5.5
NETC28_1: length 4
  Top Layer w0.3: U6.4 89.05,24.2 90.93,22.33 90.93,21.95
NETC28_2: length 5.9
  Top Layer w0.3: U6.5 89.35,24.7 90.9,23.15 92,23.15 92.47,22.68 92.47,21.95
NETC30_1: length 2.9
  Top Layer w0.3: U5.6 61.27,25.1 C30.1
NETC31_1: length 2.9
  Top Layer w0.3: 90.93,24.95 90.67,25.2 U6.6
NETC33_1: length 4
  Top Layer w0.3: U5.8 61.08,26.6 C33.1
NETC34_1: length 3.9
  Top Layer w0.3: 87.1,26.7 90.38,26.7 90.83,27.15
NETC40_1: length 11.8
  Top Layer w0.254: C40.1 35.5,1.97 Y2.2 33.85,5.1 29.56,9.39 28.68,9.39
NETC41_1: length 6.9
  Top Layer w0.254: Y2.1 29.9,1.97 C41.1 ; Y2.1 29.9,7.09 28.9,8.09 28.68,8.09 ; Y2.1 29.91,5.11
NETC43_1: length 8.8
  Top Layer w0.254: U9.13 35.9,13.2 36.3,12.8 36.3,9 37.4,7.9 38.93,7.9
NETC44_1: length 2.4
  Top Layer w0.3: 28.68,13.2 28.65,13.23 C44.1
NETD2_1: length 48
  Top Layer w0.3: D2.1 4.38,31.42 4.9,30.9 4.9,28.4 6.4,26.9 6.4,24.2 7.7,22.9 26.4,22.9 ; 17.7,22.9 26.4,22.9 ; 26.4,22.9 36.3,22.9
NETD3_1: length 47.5
  Top Layer w0.3: 26,25.2 33,25.2 ; 33,25.2 16,25.2 15,26.2 15,31.9 12.1,34.8 8.11,34.8 7.13,33.82 D3.1 ; 33,25.2 36.4,25.2
NETD5_1: length 37.8
  Top Layer w0.3: R31.1 35.9,21.3 8.3,21.3 5.8,23.8 5.8,26.8 D5.1
NETD5_2: length 150.1
  Top Layer w0.3: v1(110.5,11.5) 110.6,11.5 112.5,13.4 112.5,15.05 112.2,15.35 U4.2 ; D5.2 1.88,28.02 3,26.9 4.9,26.9 5.2,26.6 5.2,23.4 8.1,20.5 v1(20.7,20.5)
  Bottom Layer w0.3: v1(20.7,20.5) 20.7,16.8 15,11.1 15,6.8 15.7,6.1 41.3,6.1 44.1,3.3 107.2,3.3 108.8,4.9 108.8,9.8 v1(110.5,11.5)
NETD6_2: length 2.6
  Top Layer w0.254: R7.2 3.72,14.02 D6.2
NETK1_2: length 17.8
  Bottom Layer w3: P1.1 13.7,15.9 14.9,17.1 14.9,24.45 K1.2
NETP5_3: length 74.7
  Top Layer w0.3: v1(109.6,4.6) 101.6,4.6 100.8,5.4 v1(95.1,5.4) ; 119.6,8.4 118.5,9.5 v1(109.62,9.5)
  Bottom Layer w0.3: P5.3 53,5.4 v1(95.1,5.4) ; v1(109.62,9.5) 109.4,9.28 109.4,4.8 v1(109.6,4.6)
NETP6_1: length 3.9
  Top Layer w0.3: P6.1 135.8,35.1 Q1.2
NETP14_6: length 12.8
  Top Layer w0.3: P14.6 131.2,19.4 127.5,19.4 126.7,18.6 122.7,18.6 R18.2
NETP14_8: length 14.5
  Top Layer w0.3: R19.2 124.1,18 125.7,18 129.33,14.37 131.31,14.37 P14.8
NETQ1_1: length 4.1
  Top Layer w0.3: R25.2 R17.2 Q1.1
NETQ2_1: length 3.9
  Top Layer w0.3: Q2.1 95.9,23.9 R24.2
NETR11_1: length 5.4
  Top Layer w0.3: 121.2,8.4 121.7,7.9 125.35,7.9 U10.4
NETR20_1: length 9
  Top Layer w0.3: 57.5,19.85 57.2,20.15 U5.27
  Top Layer w0.6: 57.5,19.85 60.7,16.65 R20.1
NETR21_2: length 9.3
  Top Layer w0.3: 54.7,19.65 55.2,20.15 U5.23
  Top Layer w0.6: R21.2 58.39,14.96 54.7,18.65 54.7,19.65
NETR22_1: length 9
  Top Layer w0.3: U6.27 86.6,20.25 86.9,19.95
  Top Layer w0.6: 86.9,19.95 90.1,16.75 R22.1
NETR23_2: length 9.3
  Top Layer w0.3: U6.23 84.6,20.25 84.1,19.75
  Top Layer w0.6: R23.2 87.79,15.26 84.1,18.95 84.1,19.75
NETR26_1: length 6.9
  Top Layer w0.3: R26.1 55.8,35.65 55,36.45 52.5,36.45 51.8,35.75 R29.3 52.1,35.1
NETR27_1: length 7.4
  Top Layer w0.3: 81.6,35.3 R30.3 81.2,36.25 81.45,36.5 84.75,36.5 85.1,36.15 R27.1
NETR29_2: length 9
  Top Layer w0.3: U5.17 52.15,24.6 51.3,25.45 51.3,29.6 52.8,31.1
NETR30_2: length 9.5
  Top Layer w0.3: U6.17 81.55,24.7 80.7,25.55 80.7,27.4 82.2,28.9 R30.2 82.05,31.5
NETR32_2: length 8.5
  Top Layer w0.3: U5.12 55.7,28 v1(56,28.3) 57.5,29.8 R32.2 ; v1(54.4,28.3) 54.7,28 54.7,26.6
  Bottom Layer w0.3: v1(54.4,28.3) v1(56,28.3)
NETR33_2: length 8.6
  Top Layer w0.3: U6.14 84.1,28.1 v1(83.8,28.4) ; R33.2 86.9,29.9 v1(85.4,28.4) 85.1,28.1 U6.12
  Bottom Layer w0.3: v1(83.8,28.4) v1(85.4,28.4)
NETR35_2: length 8.6
  Top Layer w0.3: U5.11 56.2,27.55 56.4,27.75 56.7,27.75 ; 59.47,30.9 59.5,30.87 ; 59.5,30.87 R35.2 ; 59.5,30.87 59.5,30.55 56.7,27.75 ; U5.9 57.2,27.55 57,27.75 56.7,27.75 ; 56.7,27.75 U5.10
NETR36_2: length 8.6
  Top Layer w0.3: 86.1,27.85 86.4,27.85 86.6,27.65 U6.9 ; 86.1,27.85 85.8,27.85 85.6,27.65 U6.11 ; 86.1,27.85 88.9,30.65 R36.2 ; 86.1,27.85 U6.10
NETR37_1: length 9
  Top Layer w0.3: U7.27 71.9,20.15 72.2,19.85
  Top Layer w0.6: 75.4,14 75.4,16.65 72.2,19.85
NETR38_1: length 4.5
  Top Layer w0.3: R38.1 55.2,30.65 U5.13
NETR39_1: length 4.5
  Top Layer w0.3: U6.13 84.6,30.8 R39.1
NETR40_2: length 9.2
  Top Layer w0.3: U7.23 69.9,20.15 69.4,19.65
  Top Layer w0.6: R40.2 73,15.05 69.4,18.65 69.4,19.65
NETR41_1: length 6.5
  Top Layer w0.3: 70.5,34.75 70.5,35.65 69.7,36.45 67.2,36.45 66.5,35.75 66.5,34.8
NETR42_2: length 9
  Top Layer w0.3: U7.17 66.85,24.6 66,25.45 66,29.6 67.5,31.1
NETR43_2: length 8.5
  Top Layer w0.3: U7.12 70.4,28 v1(70.7,28.3) 72.2,29.8 72.2,30.95 ; v1(69.1,28.3) 69.4,28 69.4,26.6
  Bottom Layer w0.3: v1(69.1,28.3) v1(70.7,28.3)
NETR44_2: length 8.2
  Top Layer w0.3: U7.10 71.4,27.75 ; 71.4,27.75 74.2,30.55 ; 71.4,27.75 71.1,27.75 70.9,27.55 U7.11 ; 71.4,27.75 71.7,27.75 71.9,27.55 U7.9
NETR45_1: length 4
  Top Layer w0.3: U7.13 69.9,30.65
NETR51_1: length 17
  Top Layer w0.254: R51.1 38.05,6 37.15,6.9 33.8,6.9 31.2,9.5 31.2,14.4 29.86,15.74 28.68,15.74
NETR52_1: length 17.7
  Top Layer w0.254: R52.1 38.15,4 37.4,4.75 37.4,5.8 37,6.2 33.7,6.2 30.6,9.3 30.6,13.7 29.83,14.47 28.68,14.47
NRST: length 16
  Top Layer w0.3: 119.6,24.1 119.6,23.13 C10.2 ; 119.6,24.1 119.5,24.2 114.6,24.2 114.3,23.9 114.3,19.3 112.85,17.85 U4.7 ; 119.6,24.1 R6.2
RST: length 190
  Top Layer w0.3: C43.2 41.3,7.9 41.9,7.3 v1(41.9,6.8) ; 136,7.8 136,14.7 133.9,16.8 131.26,16.8 P14.5 ; v1(126.3,7.4) 126.2,7.3 118.7,7.3 117.1,8.9 117,8.9 ; U4.41 105.95,11.65 108.7,8.9 117,8.9 ; 117,8.9 117.58,8.32 ; C35.1 16.25,35.36 19.69,38.8
  Bottom Layer w0.3: v1(126.3,7.4) 135.3,7.4 P19.1 ; 21.9,28.2 21.9,16.93 15.5,10.53 15.5,7.2 15.9,6.8 v1(41.9,6.8) 44.7,4 107,4 108.1,5.1 108.1,9.5 v1(107.8,9.8) ; 21.9,28.2 21.9,29 21.2,29.7 ; 21.9,28.2 21.9,27.2 ; v1(20.9,29.7) v1(20.9,36.3)
RXD: length 109.6
  Top Layer w0.3: 104.1,17.35 104.65,17.35 ; 104.1,17.35 U4.31 ; 104.1,17.35 106.95,17.35 v1(108.3,16) ; R51.2 41.4,6 41.9,5.5 v1(41.9,4.4) ; R19.1 118.7,16 v1(117.2,16)
  Bottom Layer w0.3: v1(41.9,4.4) 43.7,2.6 115,2.6 117.2,4.8 v1(117.2,16) v1(108.3,16)
SPINDLE_PWM: length 30
  Top Layer w0.3: U4.29 v1(108.35,18.35) ; R13.2 119.6,10.4 v1(120.2,9.8) 123.1,9.8 U10.2
  Bottom Layer w0.3: v1(120.2,9.8) 120.2,16.8 118.65,18.35 v1(108.35,18.35)
SWCLK: length 38.4
  Top Layer w0.3: R14.1 130.4,2.6 P4.3 128.4,0.6 126.2,0.6 125.78,1.02 125.78,4.72 123.8,6.7 117.7,6.7 117.1,7.3 117.1,8.1 116.8,8.4 107.5,8.4 103.95,11.95 U4.37
SWDIO: length 38.3
  Top Layer w0.3: v1(125.5,6.3) 126.8,5 R10.1 127.06,4.84 P4.4 ; v1(104.4,16.6) 103.65,15.85 U4.34
  Bottom Layer w0.254: v1(104.4,16.6) 105.5,17.7 118.45,17.7 119.5,16.65 119.5,8.9 121,7.4 124.4,7.4 v1(125.5,6.3)
TXD: length 112.5
  Top Layer w0.3: v1(41.8,3.4) 41.2,4 R52.2 ; U4.30 103.9,17.85 ; 103.9,17.85 106.95,17.85 ; 103.9,17.85 107.45,17.85 v1(108.3,17) ; R18.1 119.5,17 v1(117.9,17)
  Bottom Layer w0.3: v1(41.8,3.4) 43.3,1.9 115.2,1.9 117.9,4.6 v1(117.9,17) v1(108.3,17)
USB_DM: length 26.2
  Top Layer w0.254: P3.A7 6.55,6.35 6.2,6.7 6.2,7.1 6.45,7.35 P3.B7 12.95,7.35 16.26,10.66 28.68,10.66
USB_DP: length 29.2
  Top Layer w0.254: 7.89,6.85 P3.A6 9.35,6.85 v1(9.8,6.4) 9.8,6.1 9.55,5.85 P3.B6
  Top Layer w0.3: 28.68,11.93 14.57,11.93 14.1,12.4 v1(12.1,12.4) R8.2
  Bottom Layer w0.3: v1(9.8,6.4) 12.1,8.7 v1(12.1,12.4)
USBV_CK: length 124.8
  Top Layer w0.3: v1(11.8,6.7) 13,6.7 13.8,7.5 v1(16.3,7.5) ; R15.1 v1(8,14) R16.2 ; v1(106.5,20.3) 106.95,20.75 U4.18
  Bottom Layer w0.3: v1(106.5,20.3) 105.3,19.1 101.7,19.1 100.7,18.1 100.7,15.8 100.1,15.2 98.8,15.2 98.2,14.6 98.2,5.56 97.34,4.7 45.1,4.7 42.3,7.5 v1(16.3,7.5) ; v1(8,14) 11.6,14 12.7,12.9 12.7,7.6 v1(11.8,6.7)
VUSB: length 48.9
  Top Layer w0.254: 7.89,4.05 7.89,4.25 6.85,4.25 5.2,5.9 5.2,7.3 ; R15.2 6.92,12.32 D6.1 5.2,12.23 5.2,7.3 ; v1(13.5,11.7) 12.3,11.7 11.1,10.5 10.1,10.5 ; v1(18.6,18.9) 21.5,18.9 22.6,20 31.7,20 32.37,19.33 C42.1 33.7,18.7 34.52,17.88 U9.16 ; 5.2,7.3 7.05,9.15 ; 10.2,10.1 9.25,9.15 P3.A4
  Bottom Layer w0.254: v1(18.6,18.9) 18.6,16.8 v1(13.5,11.7)
X_LIMT: length 19.4
  Top Layer w0.3: 97.57,11.6 97.62,11.55 ; 97.57,11.6 97.57,11.37 ; 97.57,11.6 97.6,11.62 97.6,13.6 ; 97.57,11.6 C7.2 97.77,11.5 v1(98.9,11.5) ; v1(108.45,11.5) U4.46
  Bottom Layer w0.3: P2.1 105.38,11.5 ; v1(98.9,11.5) v1(108.45,11.5)
XTAL1: length 14.9
  Top Layer w0.3: 115.4,16.85 117.65,19.1 C12.1 119.38,18.85 ; 115.4,16.85 U4.5 ; 115.4,16.85 115.7,16.55 115.7,12
XTAL2: length 13.1
  Top Layer w0.3: C11.1 116.6,21.1 115.7,22 115.7,18.3 114.75,17.35 U4.6
Y_LIMT: length 32.6
  Top Layer w0.3: U4.28 98.92,18.85 C18.2 97.67,15.67 97.6,15.6 ; R12.1 98.9,14.4 v1(98.9,12.4)
  Bottom Layer w0.3: P7.1 115.78,11.52 114.9,12.4 v1(98.9,12.4)

## Copper pours and planes (outline as drawn; the poured copper is in the pictures)
GND on Top Layer: -6.1,43.1 -6.1,-3 148.4,-3 148.4,43.1
GND on Bottom Layer: -4.2,43.8 146.2,43.8 146.2,-4.7 -4.2,-4.7
RST on Top Layer: 20.2,33.3 21.4,33.3 21.4,29.5 20.2,29.5
RST on Top Layer: 18.9,39.7 21.7,39.7 21.7,36 18.9,36

## Text on the board
Top Silkscreen Layer: LY-2Axis-4.0-V3 | RUN | 12V | 5V | PWM GND 12V | X | X-AXIS | Y1 | Y1-AXIS | Y2 | Y2-AXIS | 5V GND X-Limt | 5V GND Y-Limt | DIO CLK 3V3 GND | GND RST | +LR-
